# EasyEDA Pro project ProProject_Quadrotor_Mk2_Controller.epro

# Schematic Schematic1
Create Date: 2024-08-22; Page Name: P1; Project Name: Quadrotor_Mk2_Controller; Schematic Name: Schematic1; Update Date: 2024-08-22; Company: EasyEDA.com; Drawn: EasyEDA; Page Size: A4; Part Number: JLCPCB-002; Reviewed: EasyEDA; Version: V0.1
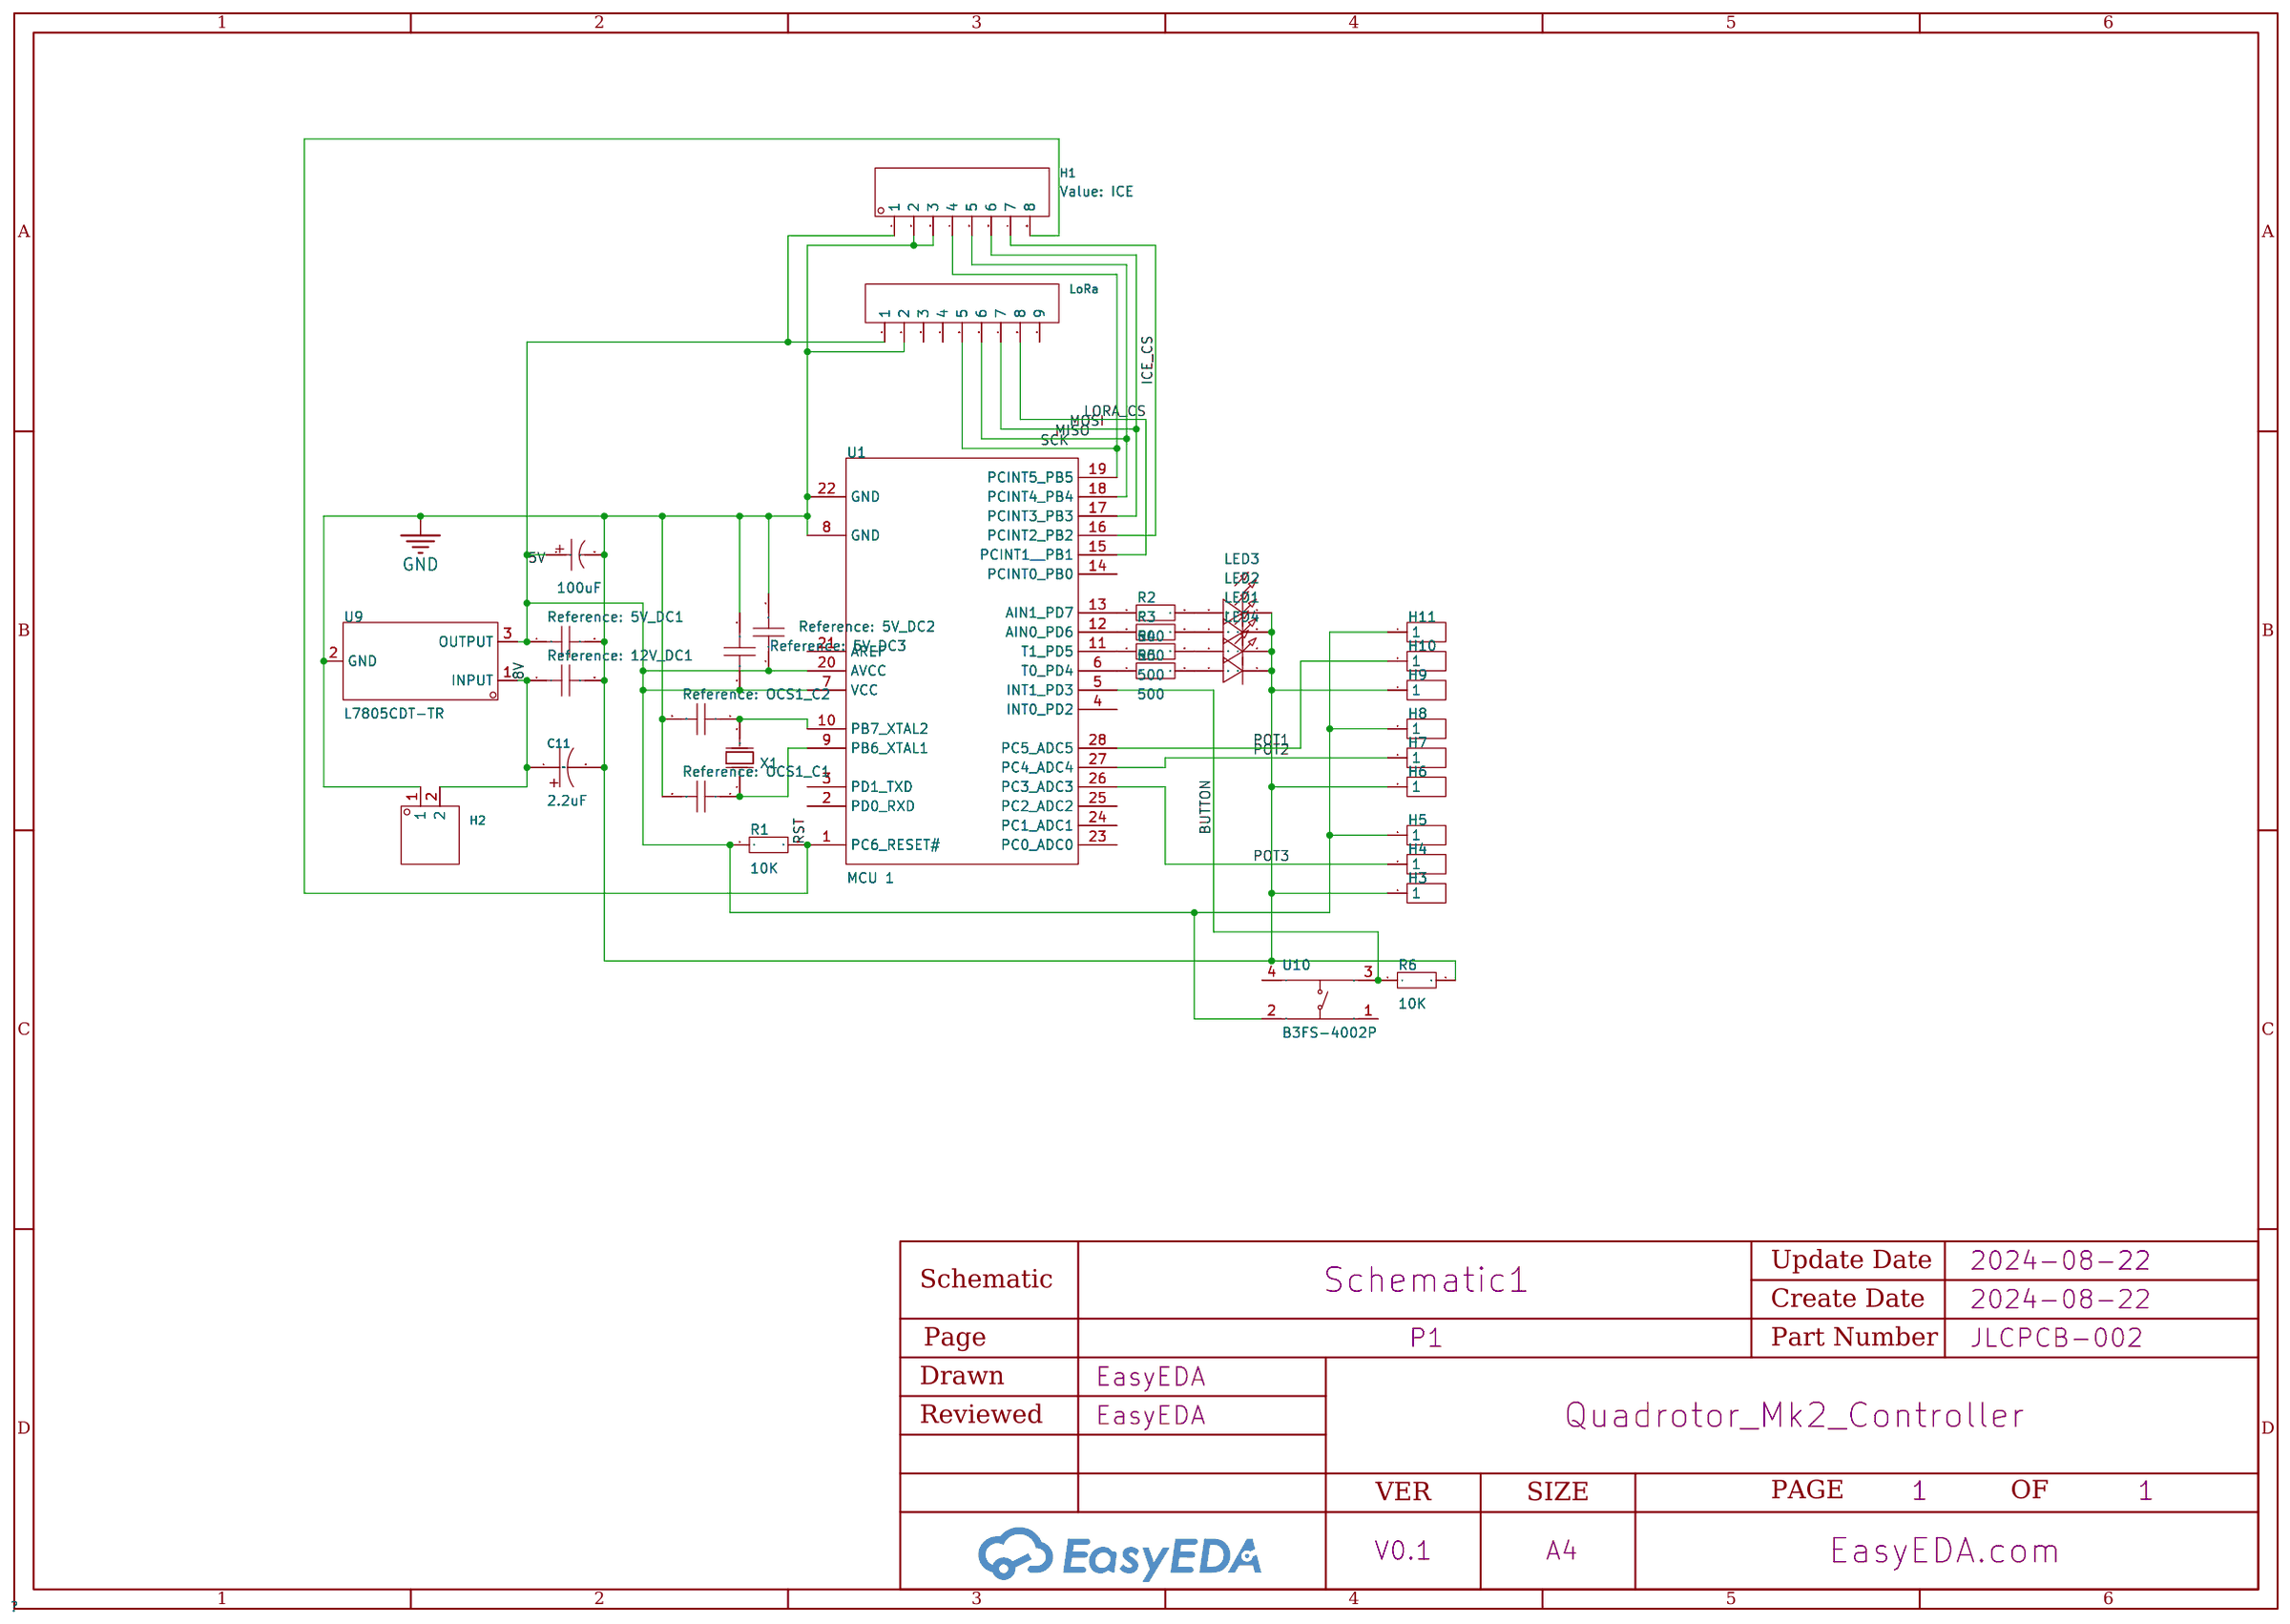
[diagram p0: schematic sheet]

## Parts
5V_DC1  100nF  [C0603]
5V_DC2  100nF  [C0603]
5V_DC3  100nF  [C0603]
12V_DC1  100nF  [C0603]
C11  2.2uF  [CAP-TH_BD5.0-P2.00-D0.8-FD]
C14  100uF  [CAP-TH_BD8.0-P3.50-D0.6-FD]
H1  ICE  [HDR-TH_8P-P2.54-V-M]
H2  -  [HDR-TH_2P-P2.54-V-M-1]
H3  -  [HDR-TH_1P-V-M_XKB_X4611WV-01I-C28D40]
H4  -  [HDR-TH_1P-V-M_XKB_X4611WV-01I-C28D40]
H5  -  [HDR-TH_1P-V-M_XKB_X4611WV-01I-C28D40]
H6  -  [HDR-TH_1P-V-M_XKB_X4611WV-01I-C28D40]
H7  -  [HDR-TH_1P-V-M_XKB_X4611WV-01I-C28D40]
H8  -  [HDR-TH_1P-V-M_XKB_X4611WV-01I-C28D40]
H9  -  [HDR-TH_1P-V-M_XKB_X4611WV-01I-C28D40]
H10  -  [HDR-TH_1P-V-M_XKB_X4611WV-01I-C28D40]
H11  -  [HDR-TH_1P-V-M_XKB_X4611WV-01I-C28D40]
LED1  -  [LED-TH_BD5.8-P2.54-RD]
LED2  -  [LED-TH_BD5.8-P2.54-RD]
LED3  -  [LED-TH_BD5.8-P2.54-RD]
LED4  -  [LED-TH_BD5.8-P2.54-RD]
LoRa  -  [HDR-TH_9P-P2.54-V-F-1]
OCS1_C1  22pF  [C0603]
OCS1_C2  22pF  [C0603]
R1  10K  [R0603]
R2  500  [R0603]
R3  500  [R0603]
R4  500  [R0603]
R5  500  [R0603]
R6  10K  [R0603]
U1  MCU 1  [DIP-28_L34.6-W7.3-P2.54-LS10.2-BL]
U9  L7805CDT-TR  [TO-252-3_L6.5-W5.8-P4.58-BL]
U10  B3FS-4002P  [KEY-SMD_4P-L12.0-W12.0-P5.00-LS15.0]
X1  20MHz  [OSC-TH_L10.0-W4.5-P5.00]

## Library data of the parts
5V_DC1-5V_DC3 12V_DC1 OCS1_C1 OCS1_C2 = CAP_0603: Supplier Footprint: 0603
C11 = RC050M2R2LO5*11TH-2A1E: Capacitance: Tolerance:±20% Tolerance:±20% Rated Voltage: Ripple Current:90mA@100kHz Lead Spacing: φD: L: Lifetime @ Temp:2000hrs@105℃ Operating Temperature:-40℃~+105℃ Operating Temperature:-40℃~+105℃; LCSC Part Name: 2.2uF ±20% 50V; Supplier Part: C365766; Manufacturer: BERYL(绿宝石); Supplier Footprint: 插件,D5xL11mm; JLCPCB Part Class: Extended Part; Datasheet: https://atta.szlcsc.com/upload/public/pdf/source/20190116/C365813_D032970E50E497412ED095DEE828BCD0.pdf; Supplier: LCSC; Tolerance: ±20%; Ripple Current: 90mA@100kHz; Lifetime @ Temp: 2000hrs@105℃; Operating Temperature: -40℃~+105℃
C14 = 50YXF100MEFC8X11.5: Capacitance: Tolerance:±20% Tolerance:±20% Rated Voltage: Lead Spacing: φD: L: Lifetime @ Temp:7000hrs@105℃ Operating Temperature:-40℃~+105℃ Operating Temperature:-40℃~+105℃; LCSC Part Name: 100uF ±20% 50V; Supplier Part: C88728; Manufacturer: rubycon(红宝石); Supplier Footprint: 插件,D8xL11.5mm; JLCPCB Part Class: Extended Part; Datasheet: https://atta.szlcsc.com/upload/public/pdf/source/20170620/1497944728803.pdf; Supplier: LCSC; Tolerance: ±20%; Lifetime @ Temp: 7000hrs@105℃; Operating Temperature: -40℃~+105℃
H1 = HDR-M_2.54_1x8P: Supplier Footprint: Through
H2 = HDR-M_2.54_1x2P: Supplier Footprint: Through
H3-H11 = HDR-M_2.54_1x1P: Supplier Footprint: Through
LED1-LED4 = LED_TH-G_5mm: Supplier Footprint: Through
LoRa = HDR-F_2.54_1x9P: Supplier Footprint: Through
R1-R6 = Res_0603: Supplier Footprint: 0603
U1 = ATMEGA328P-PU: CPU Core:AVR Program Storage Size:32KB RAM Size:2KB GPIO Ports Number:23 Operating Voltage Range:1.8V~5.5V Operating Voltage Range:1.8V~5.5V CPU Maximum Speed:20MHz Program Memory Type:FLASH EEPROM:1KB Operating Temperature Range:-40℃~+85℃ Operating Tempe; LCSC Part Name: 基于AVR增强型RISC架构的低功耗CMOS 8位微控制器 MSL=1; Supplier Part: C33901; Manufacturer: MICROCHIP(美国微芯); Supplier Footprint: DIP-28-300mil; JLCPCB Part Class: Extended Part; Datasheet: https://atta.szlcsc.com/upload/public/pdf/source/20150124/1457707257819.pdf; Supplier: LCSC; CPU Core: AVR; Program Storage Size: 32KB; RAM Size: 2KB; GPIO Ports Number: 23; Operating Voltage Range: 1.8V~5.5V; CPU Maximum Speed: 20MHz; Program Memory Type: FLASH; EEPROM: 1KB; Operating Temperature Range: -40℃~+85℃; ADC (Bit): 10bit; Peripheral/Function: WDT；PWM; Watchdog: 有; Low-Voltage Detect: 有; Internal Oscillator: 有
U9 = L7805CDT-TR: Output Type: Maximum Input Voltage:35V Output Voltage:5V Output Voltage:5V MAX Output Current:1.5A Power Supply Rejection Ratio (PSRR):62dB@(120Hz) Dropout Voltage:2V@(1A) standby current:8mA Operating Temperature:0℃~+125℃ Operating Temperature:0℃~+125℃ O; LCSC Part Name: 输入35V 输出5V 1.5A; Supplier Part: C310413; Manufacturer: ST(意法半导体); Supplier Footprint: DPAK; JLCPCB Part Class: Extended Part; Datasheet: https://atta.szlcsc.com/upload/public/pdf/source/20191219/C472632_C0855675BBC73B8C8E44EE1325AAD56A.pdf; Supplier: LCSC; Maximum Input Voltage: 35V; Output Voltage: 5V; MAX Output Current: 1.5A; Power Supply Rejection Ratio (PSRR): 62dB@(120Hz); Dropout Voltage: 2V@(1A); standby current: 8mA; Operating Temperature: 0℃~+125℃; Output Polarity: Positive electrode; Number of Outputs: 1
U10 = B3FS-4002P: Circuit:SPST-常开 Operating Force:150gf Mounting Style:Brick nogging Contact Current:50mA Operating Temperature:-25℃~+70℃ Operating Temperature:-25℃~+70℃; Supplier Part: C6509079; Manufacturer: OMRON(欧姆龙); JLCPCB Part Class: Extended Part; Supplier: LCSC; Circuit: SPST-常开; Operating Force: 150gf; Mounting Style: Brick nogging; Contact Current: 50mA; Operating Temperature: -25℃~+70℃
X1 = 49SAC16000182060: Crystal Type:直插晶振 Frequency: Normal temperature Frequency Tolerance:±20ppm Normal temperature Frequency Tolerance:±20ppm External load capacitor: Frequency Stability(Full temperature range):±30ppm Frequency Stability(Full temperature range):±30ppm Equival; LCSC Part Name: 16MHz ±20ppm 18pF; Supplier Part: C443538; Manufacturer: JGHC(晶光华); Supplier Footprint: HC-49S; JLCPCB Part Class: Extended Part; Datasheet: https://atta.szlcsc.com/upload/public/pdf/source/20191118/C443544_FEE5A62AFE1FD73D91893808184C550C.pdf; Supplier: LCSC; Crystal Type: 直插晶振; Normal temperature Frequency Tolerance: ±20ppm; Frequency Stability(Full temperature range): ±30ppm; Equivalent Series Resistance (ESR): 60Ω

## Nets
5V: 5V_DC1.1 5V_DC2.1 5V_DC3.1 C14.1 H1.1 H5.1 H8.1 H11.1 LoRa.1 R1.1 U1.7(VCC) U1.20(AVCC) U9.3(OUTPUT) U10.2
8V: 12V_DC1.1 C11.1 H2.2 U9.1(INPUT)
GND: 5V_DC1.2 5V_DC2.2 5V_DC3.2 12V_DC1.2 C11.2 C14.2 H1.2 H1.3 H2.1 H3.1 H6.1 H9.1 LED1.2(A) LED2.2(A) LED3.2(A) LED4.2(A) LoRa.2 OCS1_C1.2 OCS1_C2.2 R6.2 U1.8(GND) U1.22(GND) U9.2(GND)
BUTTON: R6.1 U1.5(INT1 PD3) U10.3
ICE_CS: H1.7 U1.16(PCINT2 PB2)
LORA_CS: LoRa.8 U1.15(PCINT1  PB1)
MISO: H1.5 LoRa.6 U1.18(PCINT4 PB4)
MOSI: H1.6 LoRa.7 U1.17(PCINT3 PB3)
POT1: H10.1 U1.28(PC5 ADC5)
POT2: H7.1 U1.27(PC4 ADC4)
POT3: H4.1 U1.26(PC3 ADC3)
RST: H1.8 R1.2 U1.1(PC6 RESET#)
SCK: H1.4 LoRa.5 U1.19(PCINT5 PB5)
$1N715: OCS1_C2.1 U1.10(PB7 XTAL2) X1.2(OSC2)
$1N726: OCS1_C1.1 U1.9(PB6 XTAL1) X1.1(OSC1)
$1N738: R2.1 U1.13(AIN1 PD7)
$1N742: R3.1 U1.12(AIN0 PD6)
$1N745: R4.1 U1.11(T1 PD5)
$1N903: LED1.1(C) R4.2
$1N928: LED2.1(C) R3.2
$1N953: LED3.1(C) R2.2
$1N1025: LED4.1(C) R5.2
$1N1027: R5.1 U1.6(T0 PD4)

Not connected (* = marked no-connect by the designer): LoRa 3 4 9; U1 2(PD0 RXD) 3(PD1 TXD) 4(INT0 PD2) 14(PCINT0 PB0) 21(AREF) 23(PC0 ADC0) 24(PC1 ADC1) 25(PC2 ADC2); U10 1 4

# Board PCB1
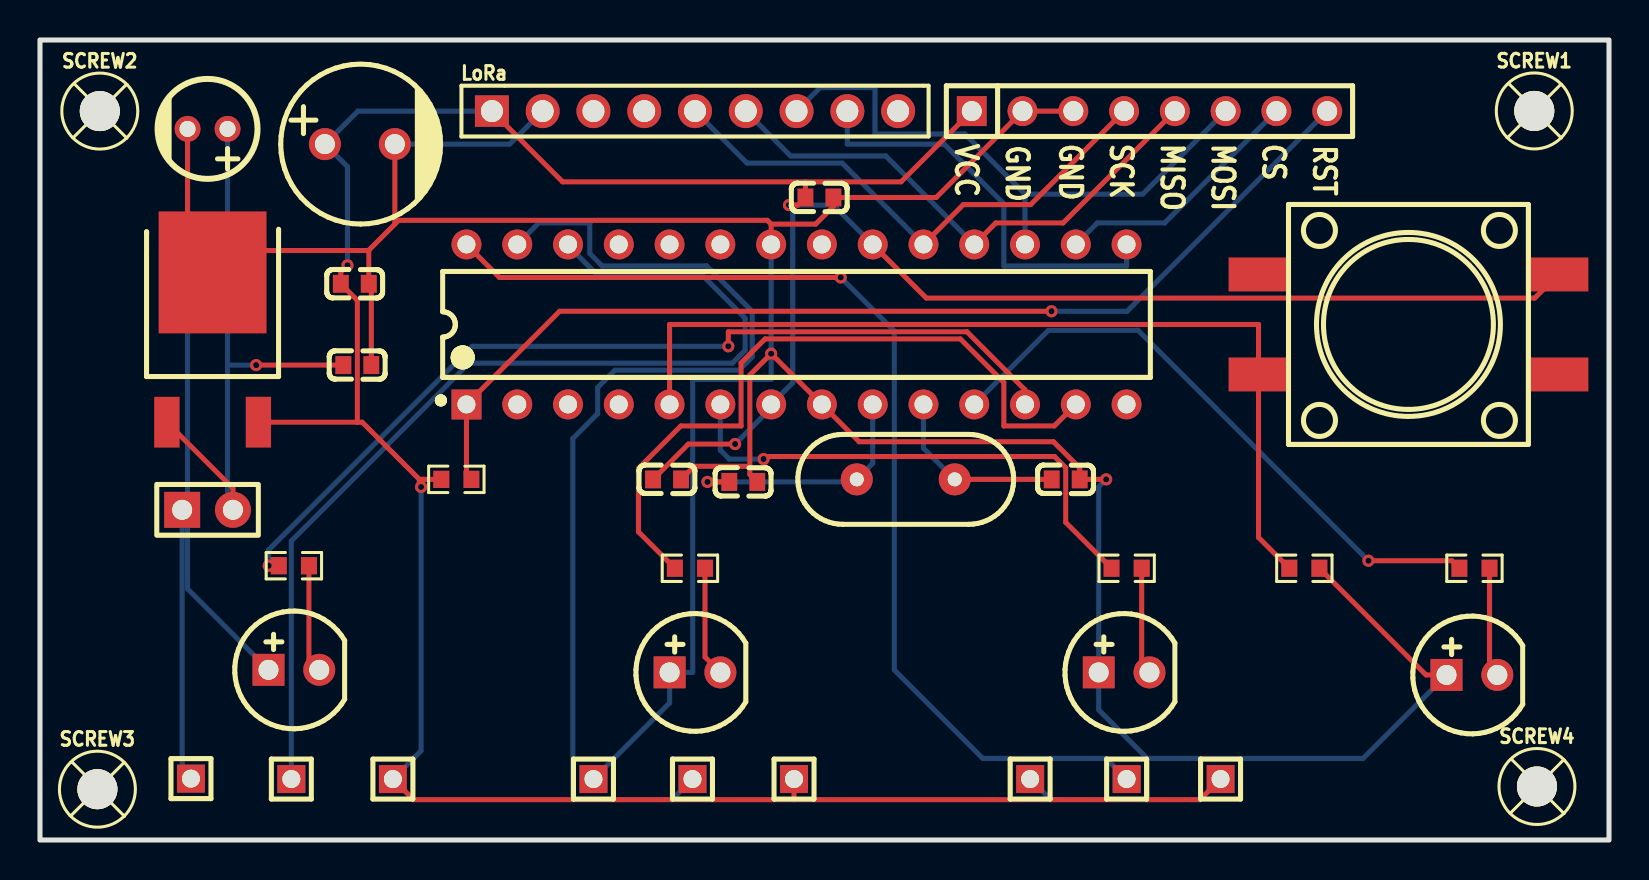
[diagram p1: board, top side]
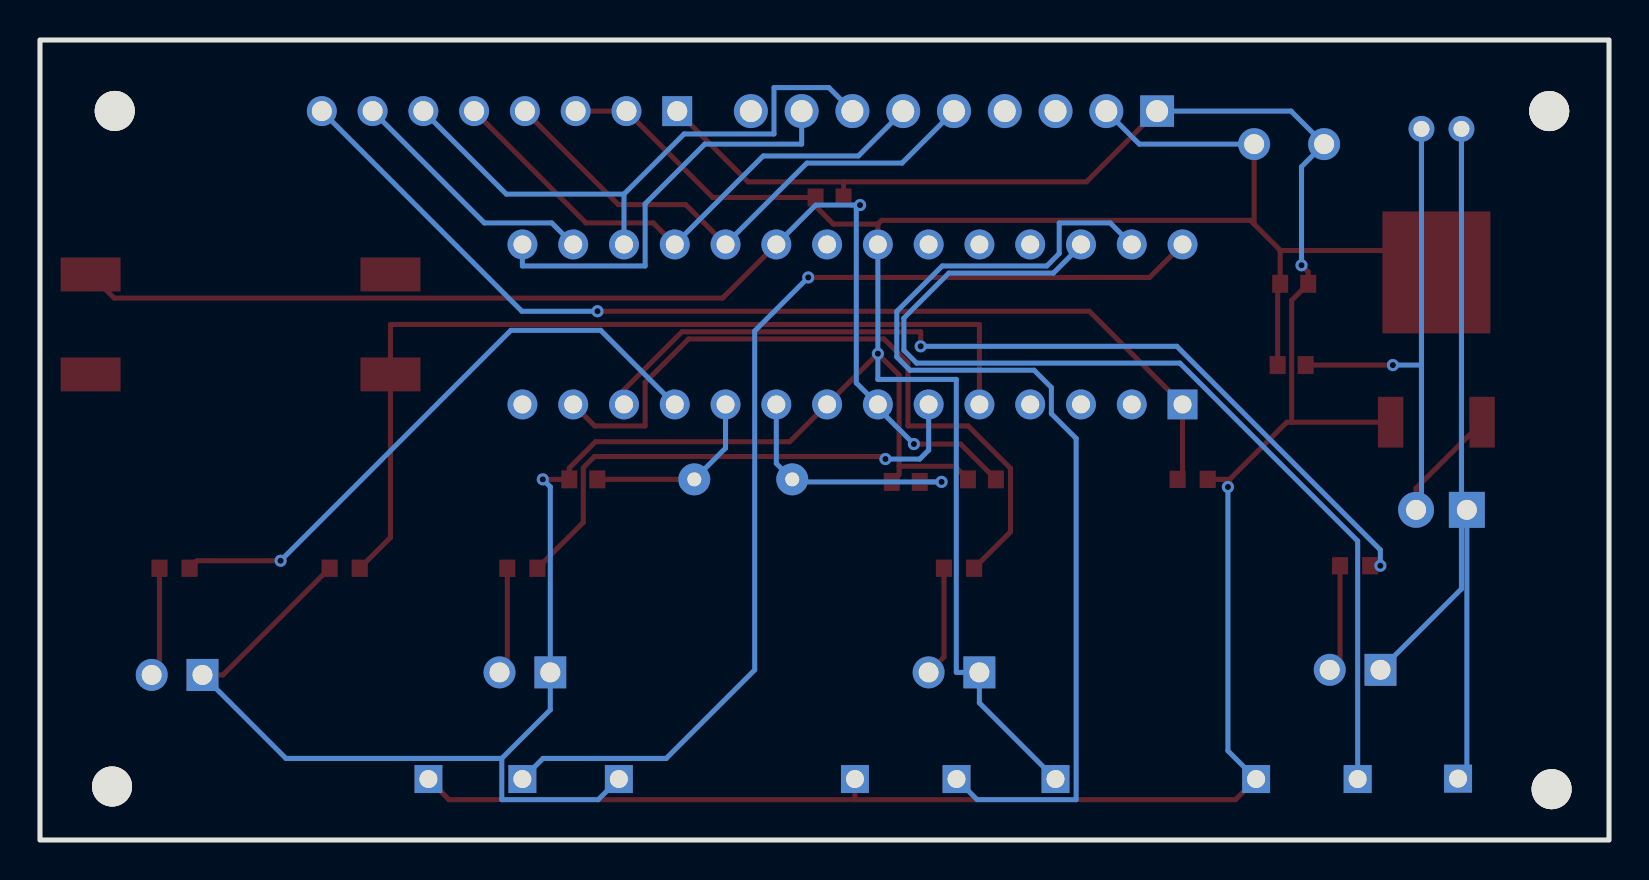
[diagram p2: board, bottom side, seen from below]

Outline 78.49 x 40 mm; copper layers: Top Layer, Bottom Layer. Coordinates in mm from the lower left corner of the outline.
Outline path: rectangle 0,40 78.49,0
Stack: Top Layer 0.035mm / Dielectric1 1.51mm FR4 er 4.5 / Bottom Layer 0.035mm

## Design rules (mm)
template: JLCPCB Capability(Two Layers Board)
spacing copperThickness1oz (default): track to track 0.102, other pairs 0.152 to 0.3
spacing copperThickness2oz: track to track 0.203, other pairs 0.152 to 0.3
track width copperThickness1oz (default): min 0.127, default 0.254, max 2.54
track width copperThickness2oz: min 0.203, default 0.254, max 2.54
differential pair differentialPair (default): width min 0.127, default 0.254, max 2.54; gap min 0.152, default 0.152
via viaSize (default): diameter min 0.5, default 0.61, max 10; hole min 0.3, default 0.305, max 6.3

## Placement (name value [footprint] x y rotation side)
5V_DC1  100nF  [C0603]  15.75 27.81 0 top
5V_DC2  100nF  [C0603]  31.37 18.03 0 top
5V_DC3  100nF  [C0603]  38.99 32.13 0 top
12V_DC1  100nF  [C0603]  15.88 23.75 0 top
C11  2.2uF  [CAP-TH_BD5.0-P2.00-D0.8-FD]  8.38 35.56 180 top
C14  100uF  [CAP-TH_BD8.0-P3.50-D0.6-FD]  16 34.8 0 top
H1  ICE  [HDR-TH_8P-P2.54-V-M]  55.5 36.45 0 top
H2  -  [HDR-TH_2P-P2.54-V-M-1]  8.38 16.51 0 top
H3  -  [HDR-TH_1P-V-M_XKB_X4611WV-01I-C28D40]  7.55 3.07 270 top
H4  -  [HDR-TH_1P-V-M_XKB_X4611WV-01I-C28D40]  12.57 3.05 270 top
H5  -  [HDR-TH_1P-V-M_XKB_X4611WV-01I-C28D40]  17.65 3.05 270 top
H6  -  [HDR-TH_1P-V-M_XKB_X4611WV-01I-C28D40]  27.69 3.05 270 top
H7  -  [HDR-TH_1P-V-M_XKB_X4611WV-01I-C28D40]  32.64 3.05 270 top
H8  -  [HDR-TH_1P-V-M_XKB_X4611WV-01I-C28D40]  37.72 3.05 270 top
H9  -  [HDR-TH_1P-V-M_XKB_X4611WV-01I-C28D40]  49.53 3.05 270 top
H10  -  [HDR-TH_1P-V-M_XKB_X4611WV-01I-C28D40]  54.36 3.05 270 top
H11  -  [HDR-TH_1P-V-M_XKB_X4611WV-01I-C28D40]  59.06 3.05 270 top
LED1  -  [LED-TH_BD5.8-P2.54-RD]  71.63 8.25 0 top
LED2  -  [LED-TH_BD5.8-P2.54-RD]  12.7 8.51 0 top
LED3  -  [LED-TH_BD5.8-P2.54-RD]  32.77 8.38 0 top
LED4  -  [LED-TH_BD5.8-P2.54-RD]  54.23 8.38 0 top
LoRa  -  [HDR-TH_9P-P2.54-V-F-1]  32.77 36.45 0 top
OCS1_C1  22pF  [C0603]  35.18 17.91 0 top
OCS1_C2  22pF  [C0603]  51.31 18.03 0 top
R1  10K  [R0603]  20.83 18.03 0 top
R2  500  [R0603]  32.51 13.59 0 top
R3  500  [R0603]  12.7 13.72 0 top
R4  500  [R0603]  71.75 13.59 0 top
R5  500  [R0603]  54.36 13.59 0 top
R6  10K  [R0603]  63.25 13.59 0 top
SCREW1  -  [Screw-Hole-M2]  74.75 36.46 0 top
SCREW2  -  [Screw-Hole-M2]  2.99 36.45 0 top
SCREW3  -  [Screw-Hole-M2]  2.87 2.54 0 top
SCREW4  -  [Screw-Hole-M2]  74.88 2.68 0 top
U1  MCU 1  [DIP-28_L34.6-W7.3-P2.54-LS10.2-BL]  37.84 25.78 0 top
U9  L7805CDT-TR  [TO-252-3_L6.5-W5.8-P4.58-BL]  8.64 24.64 0 top
U10  B3FS-4002P  [KEY-SMD_4P-L12.0-W12.0-P5.00-LS15.0]  68.45 25.78 0 top
X1  20MHz  [OSC-TH_L10.0-W4.5-P5.00]  43.31 18.03 90 top

## Footprints (pads in the part's own frame, mm; a bottom-side part is the same pattern mirrored in y, then rotated)
C0603
  rect 0.8x0.9 smd: 1(-0.7,0) 2(0.7,0)
CAP-TH_BD5.0-P2.00-D0.8-FD
  round 1.3 hole 0.8: 1(-1,0) 2(1,0)
CAP-TH_BD8.0-P3.50-D0.6-FD
  round 1.6 hole 1: 1(-1.75,0) 2(1.75,0)
DIP-28_L34.6-W7.3-P2.54-LS10.2-BL
  rect 1.5x1.5 hole 0.9: 1(-16.51,-4)
  round 1.5 hole 0.9: 2(-13.97,-4) 3(-11.43,-4) 4(-8.89,-4) 5(-6.35,-4) 6(-3.81,-4) 7(-1.27,-4) 8(1.27,-4) 9(3.81,-4) 10(6.35,-4) 11(8.89,-4) 12(11.43,-4) 13(13.97,-4) 14(16.51,-4) 15(16.51,4) 16(13.97,4) 17(11.43,4) 18(8.89,4) 19(6.35,4) 20(3.81,4) 21(1.27,4) 22(-1.27,4) 23(-3.81,4) 24(-6.35,4) 25(-8.89,4) 26(-11.43,4) 27(-13.97,4) 28(-16.51,4)
HDR-TH_1P-V-M_XKB_X4611WV-01I-C28D40
  rect 1.4x1.4 hole 0.9: 1(0,0)
HDR-TH_2P-P2.54-V-M-1
  rect 1.8x1.8 hole 1: 1(-1.27,0)
  round 1.8 hole 1: 2(1.27,0)
HDR-TH_8P-P2.54-V-M
  rect 1.5x1.5 hole 1: 1(-8.89,0)
  round 1.5 hole 1: 2(-6.35,0) 3(-3.81,0) 4(-1.27,0) 5(1.27,0) 6(3.81,0) 7(6.35,0) 8(8.89,0)
HDR-TH_9P-P2.54-V-F-1
  rect 1.7x1.575 hole 1.1: 1(-10.16,0)
  round 1.7 hole 1.1: 2(-7.62,0) 3(-5.08,0) 4(-2.54,0) 5(0,0) 6(2.54,0) 7(5.08,0) 8(7.62,0) 9(10.16,0)
KEY-SMD_4P-L12.0-W12.0-P5.00-LS15.0
  rect 3x1.7 smd: 1(-7.5,2.5) 2(7.5,2.5) 3(-7.5,-2.5) 4(7.5,-2.5)
LED-TH_BD5.8-P2.54-RD
  round 1.6 hole 1: 1(1.27,0)
  rect 1.6x1.6 hole 1: 2(-1.27,0)
OSC-TH_L10.0-W4.5-P5.00
  round 1.6 hole 0.7: 1(0,2.45) 2(0,-2.45)
R0603
  rect 0.806x0.864 smd: 1(-0.753,0) 2(0.753,0)
Screw-Hole-M2
  round 2 hole 2: 1(0,0)
TO-252-3_L6.5-W5.8-P4.58-BL
  rect 1.27x2.54 smd: 1(-2.288,-3.747) 3(2.288,-3.745)
  rect 5.4x6.1 smd: 2(-0.002,3.747)

## Nets
As in the schematic.

Pads without a net: LoRa 3 4 9; SCREW1 1; SCREW2 1; SCREW3 1; SCREW4 1; U1 2 3 4 14 21 23 24 25; U10 1 4

## Via types
v1: diameter 0.61, hole 0.305, Top Layer to Bottom Layer, 14 vias

## Routing (per net, layer and track width the routed paths; a pad name or vN(x,y) marks a point on that pad's centre or on a via; arc(x,y) is an arc through that point)
5V: length 180.8
  Top Layer w0.254: 18.97,18.03 18.97,17.74 v1(19.06,17.65) ; 18.97,18.03 R1.1 ; 18.97,18.03 16.12,20.89 15.88,20.89 ; v1(15.38,28.74) 15.05,28.41 5V_DC1.1 15.88,26.99 15.88,20.89 ; 5V_DC2.1 32.44,19.8 v1(34.77,19.8) ; 15.88,20.89 U9.3 ; LoRa.1 26.14,32.91 38.29,32.91 ; U1.20 44.33,27.1 74.77,27.1 U10.2 ; 38.29,32.91 43.07,32.91 H1.1 ; 38.29,32.91 38.29,32.13 37.91,31.75 v1(37.47,31.75) ; 37.72,2.02 H8.1 ; 37.72,2.02 58.02,2.02 H11.1 ; 37.72,2.02 18.68,2.02 H5.1
  Bottom Layer w0.254: v1(34.77,19.8) 36.57,21.6 U1.7 37.65,22.86 37.65,31.56 v1(37.47,31.75) 39.68,31.75 U1.20 ; H5.1 19.06,4.46 v1(19.06,17.65) ; v1(15.38,28.74) 15.38,33.67 C14.1 15.9,36.45 LoRa.1
8V: length 30.7
  Top Layer w0.254: v1(10.81,23.75) 12V_DC1.1 ; H2.2 9.65,17.59 U9.1
  Bottom Layer w0.254: H2.2 9.38,16.78 9.38,23.75 ; C11.1 9.38,23.75 ; 9.38,23.75 v1(10.81,23.75)
GND: length 228.5
  Top Layer w0.254: 16.45,29.48 5V_DC1.2 16.58,27.69 12V_DC1.2 ; 16.45,29.48 9.73,29.48 U9.2 7.38,29.64 C11.2 ; 16.45,29.48 16.45,29.49 17.75,30.8 ; v1(36.57,24.32) 35.51,23.25 35.51,18.69 ; 17.75,30.8 C14.2 ; 17.75,30.8 17.94,30.99 36.38,30.99 36.57,30.8 ; U1.22 36.57,30.8 ; 36.57,30.8 38.8,30.8 39.69,31.69 5V_DC3.2 44.83,32.13 H1.2 H1.3 ; 5V_DC2.2 32.72,18.69 35.51,18.69 ; 35.51,18.69 35.51,18.28 OCS1_C1.2 ; v1(53.33,18.03) OCS1_C2.2 52.01,18.6 50.7,19.92 40.98,19.92 U1.8 36.58,24.32 ; LED1.2 69.33,8.25 R6.2
  Bottom Layer w0.254: 55.39,4.08 66.18,4.08 LED1.2 ; 55.39,4.08 55.39,2.02 50.56,2.02 H9.1 ; 55.39,4.08 52.96,6.51 52.96,17.66 v1(53.33,18.03) ; LED2.2 7.38,12.56 7.38,16.51 ; H6.1 31.5,6.86 LED3.2 32.65,8.38 32.65,23.03 36.57,23.03 v1(36.57,24.32) U1.22 ; H3.1 7.11,3.51 H2.1 7.38,16.51 ; LoRa.2 23.5,34.8 C14.2 ; 7.38,16.51 C11.2
BUTTON: length 46.3
  Top Layer w0.254: R6.1 60.95,15.13 U10.3 60.95,25.78 31.49,25.78 U1.5
ICE_CS: length 12.8
  Bottom Layer w0.254: H1.7 56.26,30.86 52.89,30.86 U1.16
LORA_CS: length 21
  Bottom Layer w0.254: U1.15 54.35,28.71 48.21,28.71 48.21,31.81 45.23,34.8 40.39,34.8 LoRa.8
MISO: length 27
  Top Layer w0.254: H1.5 51.18,30.86 47.81,30.86 U1.18
  Bottom Layer w0.254: LoRa.6 37.55,34.21 42.31,34.21 U1.18
MOSI: length 29.8
  Bottom Layer w0.254: U1.17 49.27,32.3 ; 49.27,32.3 55.16,32.3 H1.6 ; 49.27,32.3 46.27,35.31 41.77,35.31 41.77,37.62 39.02,37.62 LoRa.7
POT1: length 54
  Top Layer w0.254: v1(40.05,28.13) 22.98,28.13 U1.28
  Bottom Layer w0.254: v1(40.05,28.13) 42.73,25.45 42.73,8.5 47.16,4.08 53.32,4.08 H10.1
POT2: length 53.1
  Bottom Layer w0.254: H7.1 31.61,2.02 26.66,2.02 26.66,20.08 27.89,21.32 27.89,22.63 28.76,23.49 34.97,23.49 35.63,24.15 35.63,26.43 33.35,28.71 28.12,28.71 27.5,29.33 27.5,30.86 24.95,30.86 U1.27
POT3: length 50.6
  Bottom Layer w0.254: U1.26 26.41,29.73 27.79,28.35 33.02,28.35 35.27,26.1 35.27,24.48 34.63,23.85 21.47,23.85 12.57,14.95 H4.1
RST: length 53
  Top Layer w0.254: R1.2 21.33,18.28 U1.1 25.99,26.44 v1(50.6,26.44)
  Bottom Layer w0.254: H1.8 54.38,26.44 v1(50.6,26.44)
SCK: length 27
  Top Layer w0.254: H1.4 49.55,31.77 46.19,31.77 U1.19
  Bottom Layer w0.254: U1.19 40.12,33.85 35.37,33.85 LoRa.5
$1N715: length 9.2
  Top Layer w0.254: X1.2 OCS1_C2.1
  Bottom Layer w0.254: U1.10 44.19,19.6 X1.2
$1N726: length 12.7
  Top Layer w0.254: v1(33.39,17.91) OCS1_C1.1
  Bottom Layer w0.254: v1(33.39,17.91) 40.73,17.91 X1.1 41.65,18.83 U1.9
$1N738: length 35.7
  Top Layer w0.254: R2.1 29.94,15.41 29.94,18.59 32.06,20.71 35.07,20.71 35.07,23.86 36.27,25.06 46.04,25.06 48.21,22.88 48.21,20.71 50.74,20.71 U1.13
$1N742: length 46
  Top Layer w0.254: v1(11.44,13.72) R3.1 ; v1(34.43,24.69) 34.43,25.41 46.37,25.41 49.27,22.51 U1.12
  Bottom Layer w0.254: v1(34.43,24.69) 21.62,24.69 11.44,14.51 v1(11.44,13.72)
$1N745: length 30.7
  Top Layer w0.254: R4.1 70.63,13.96 v1(66.45,13.96)
  Bottom Layer w0.254: U1.11 50.44,25.49 54.93,25.49 v1(66.45,13.96)
$1N903: length 5.5
  Top Layer w0.254: R4.2 72.51,8.64 LED1.1
$1N928: length 5.4
  Top Layer w0.254: R3.2 13.45,9.03 LED2.1
$1N953: length 5.5
  Top Layer w0.254: LED3.1 33.27,9.15 R2.2
$1N1025: length 5.4
  Top Layer w0.254: R5.2 55.11,8.77 LED4.1
$1N1027: length 26
  Top Layer w0.254: R5.1 51.31,15.88 51.31,18.62 50.75,19.18 36.32,19.18 v1(36.19,19.05)
  Bottom Layer w0.254: U1.6 34.03,19.5 34.48,19.05 v1(36.19,19.05)

## Text on the board
Top Silkscreen Layer: VCC | GND | SCK | MISO | MOSI | CS | RST
